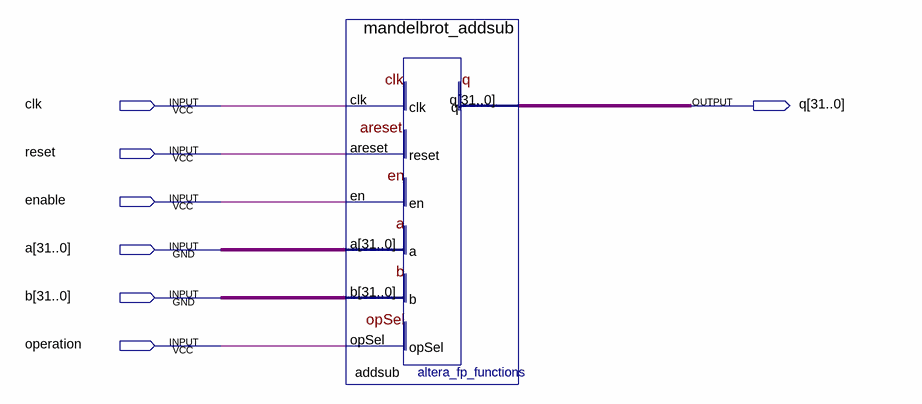
[diagram p0: schematic sheet]
// Quartus schematic addsub.bdf as structural Verilog: 1 symbols, 7 pins
module addsub (
  input  clk,
  input  reset,
  input  enable,
  input  [31:0] a,
  input  [31:0] b,
  input  operation,
  output [31:0] q
);

  mandelbrot_addsub addsub (.clk(clk), .areset(reset), .en(enable), .a(a), .b(b), .opSel(operation), .q(q));
endmodule
